# EAGLE schematic WiringDiagram (EAGLE 6.6.0)
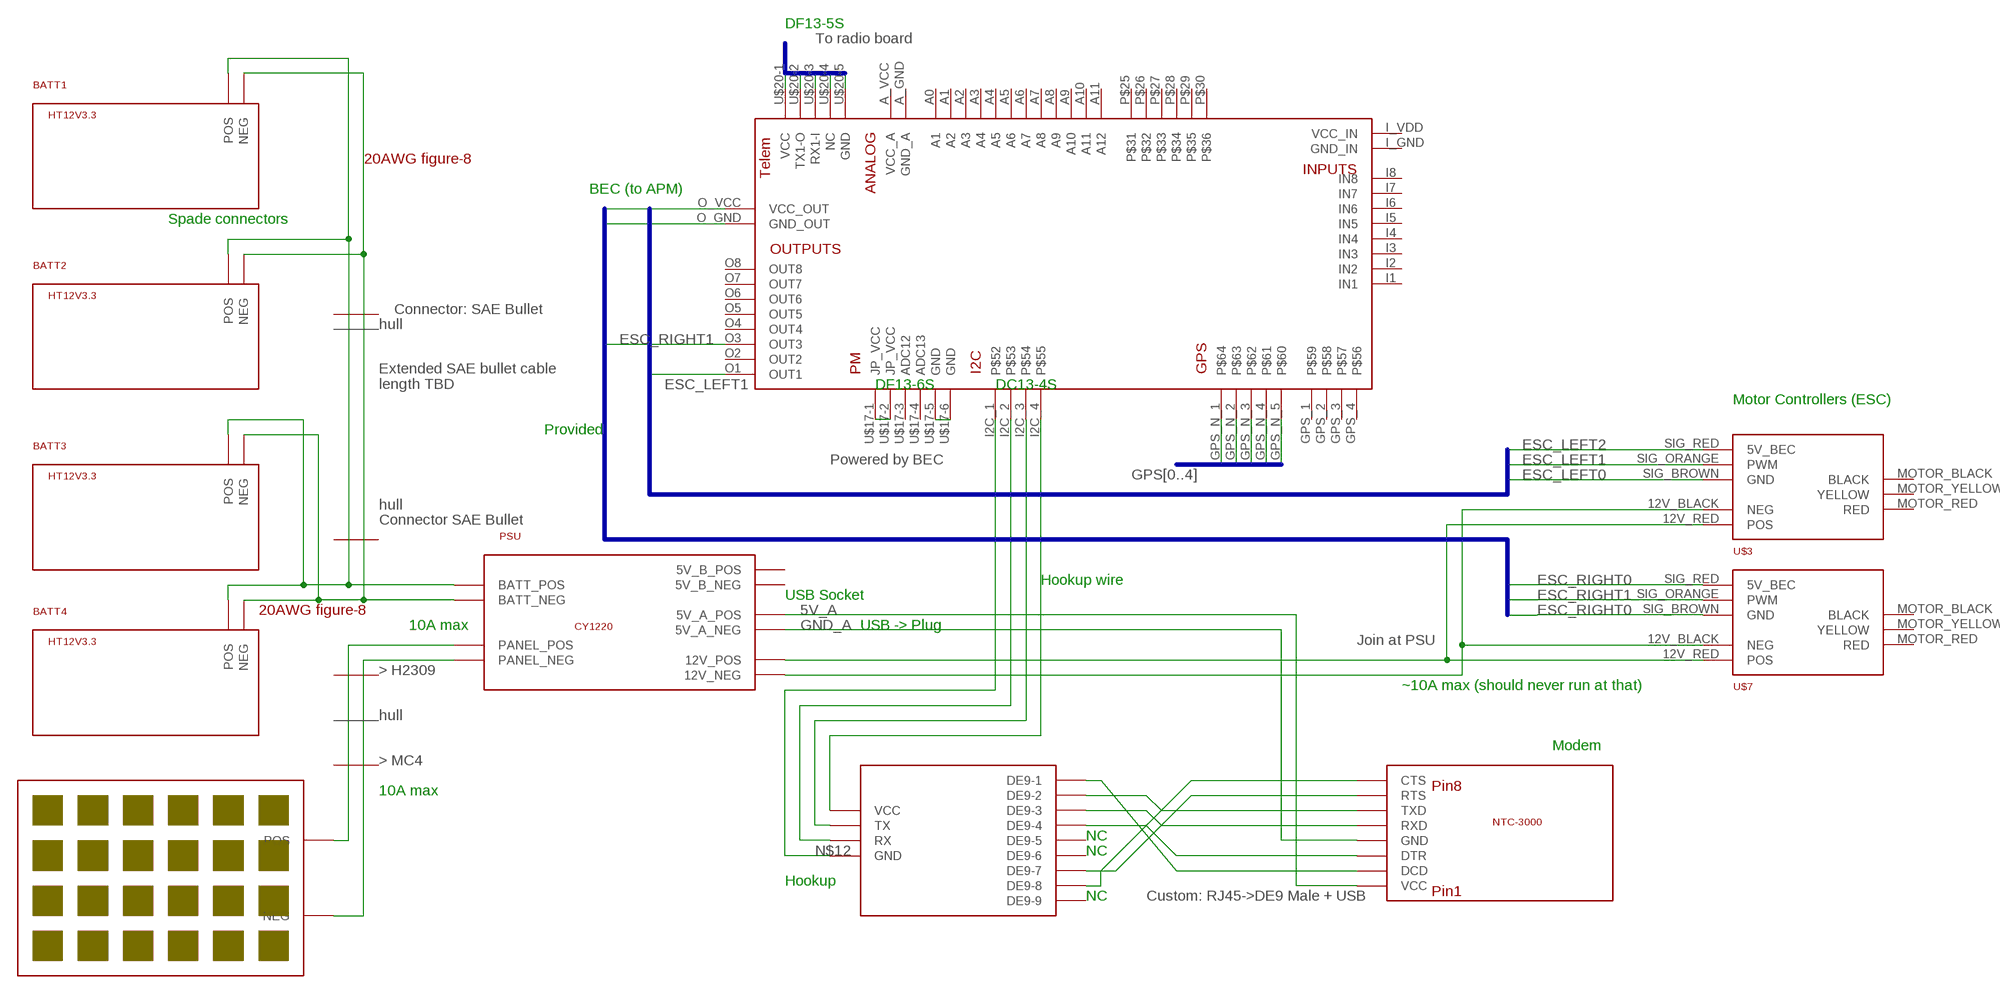
[diagram p0: schematic, sheet 1]

## Parts
BATT1  HT12V3.3  (no package)
BATT2  HT12V3.3  (no package)
BATT3  HT12V3.3  (no package)
BATT4  HT12V3.3  (no package)
MAX232  MAX3232  (no package)
PSU  CY1220  (no package)
U$1  ARDUCOPTER2.8  [ARDUCOPTER2.8]
U$2  SOLARPANEL  (no package)
U$3  BESC30-R1  [BESC30-R1]
U$5  NTC-3000  (no package)
U$7  BESC30-R1  [BESC30-R1]

## Nets
5V_A: PSU.5V_A_POS U$5.VCC
ESC_LEFT0: U$1.O_GND(GND_OUT) U$3.SIG_BROWN(GND)
ESC_LEFT1: U$1.O1(OUT1) U$3.SIG_ORANGE(PWM)
ESC_LEFT2: U$1.O_VCC(VCC_OUT) U$3.SIG_RED(5V_BEC)
ESC_RIGHT0: U$7.SIG_BROWN(GND) U$7.SIG_RED(5V_BEC)
ESC_RIGHT1: U$1.O3(OUT3) U$7.SIG_ORANGE(PWM)
GND_A: PSU.5V_A_NEG U$5.GND
GPS0: U$1.GPS_N_1 U$1.GPS_N_2
GPS2: U$1.GPS_N_3
GPS3: U$1.GPS_N_4
GPS4: U$1.GPS_N_5
N$3: PSU.12V_NEG U$3.12V_BLACK(NEG) U$7.12V_BLACK(NEG)
N$4: PSU.12V_POS U$3.12V_RED(POS) U$7.12V_RED(POS)
N$5: MAX232.DE9-1 U$5.DCD
N$6: MAX232.DE9-2 U$5.TXD
N$7: MAX232.DE9-3 U$5.RXD
N$8: MAX232.DE9-4 U$5.DTR
N$9: MAX232.DE9-7 U$5.RTS
N$10: MAX232.DE9-8 U$5.CTS
N$11: MAX232.RX U$1.I2C_2
N$12: MAX232.GND U$1.I2C_1
N$13: MAX232.TX U$1.I2C_3
N$14: MAX232.VCC
N$15: BATT1.POS BATT2.POS BATT3.POS BATT4.POS PSU.BATT_POS
N$16: U$2.POS
N$17: PSU.PANEL_NEG U$2.NEG
N$18: U$1.U$17-1(JP_VCC) U$1.U$17-2(JP_VCC)
N$19: U$1.U$17-5(GND) U$1.U$17-6(GND)
N$20: BATT1.NEG BATT2.NEG BATT3.NEG BATT4.NEG PSU.BATT_NEG
TELEM0: U$1.U$20-1(VCC)
TELEM1: U$1.U$20-2(TX1-O)
TELEM2: U$1.U$20-3(RX1-I)
TELEM3: U$1.U$20-4(NC)
TELEM4: U$1.U$20-5(GND)
Unconnected: MAX232.DE9-5 MAX232.DE9-6 MAX232.DE9-9 PSU.5V_B_NEG PSU.5V_B_POS PSU.PANEL_POS U$1.A0(A1) U$1.A1(A2) U$1.A2(A3) U$1.A3(A4) U$1.A4(A5) U$1.A5(A6) U$1.A6(A7) U$1.A7(A8) U$1.A8(A9) U$1.A9(A10) U$1.A10(A11) U$1.A11(A12) U$1.A_GND(GND_A) U$1.A_VCC(VCC_A) U$1.GPS_1 U$1.GPS_2 U$1.GPS_3 U$1.GPS_4 U$1.I1(IN1) U$1.I2(IN2) U$1.I2C_4 U$1.I3(IN3) U$1.I4(IN4) U$1.I5(IN5) U$1.I6(IN6) U$1.I7(IN7) U$1.I8(IN8) U$1.I_GND(GND_IN) U$1.I_VDD(VCC_IN) U$1.O2(OUT2) U$1.O4(OUT4) U$1.O5(OUT5) U$1.O6(OUT6) U$1.O7(OUT7) U$1.O8(OUT8) U$1.P$25 U$1.P$26 U$1.P$27 U$1.P$28 U$1.P$29 U$1.P$30 U$1.U$17-3(ADC12) U$1.U$17-4(ADC13) U$3.MOTOR_BLACK(BLACK) U$3.MOTOR_RED(RED) U$3.MOTOR_YELLOW(YELLOW) U$7.MOTOR_BLACK(BLACK) U$7.MOTOR_RED(RED) U$7.MOTOR_YELLOW(YELLOW)

## Buses
GPS[0..4]
TELEM[0..4]
ESC_LEFT[0..2]
ESC_RIGHT[0..2]

## Notes on the sheet
- DF13-5S
- To radio board
- 20AWG figure-8
- BEC (to APM)
- Spade connectors
- Connector: SAE Bullet
- hull
- Extended SAE bullet cable
  length TBD
- DF13-6S | DC13-4S
- Motor Controllers (ESC)
- Provided
- Powered by BEC
- hull
- Connector SAE Bullet
- Hookup wire
- USB Socket
- 20AWG figure-8
- 10A max | USB -> Plug
- Join at PSU
- > H2309
- ~10A max (should never run at that)
- hull
- Modem
- > MC4
- 10A max
- NC
- NC
- Hookup
- NC | Custom: RJ45->DE9 Male + USB

## Library data of the parts
BATT1-BATT4 = parts:HT12V3.3
MAX232 = parts:MAX3232
PSU = parts:CY1220
U$1 = parts:ARDUCOPTER2.8
U$2 = parts:SOLARPANEL
U$3 U$7 = parts:BESC30-R1
U$5 = parts:NTC-3000